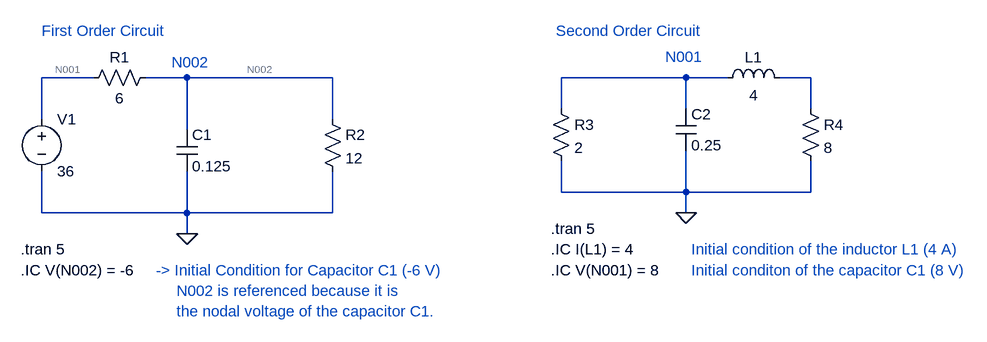
[diagram p0: schematic 03 First and Second Order Circuits.asc]
03 First and Second Order Circuits.asc, the LTspice schematic file:
Version 4
SHEET 1 1616 680
WIRE 224 64 144 64
WIRE 368 64 304 64
WIRE 592 64 368 64
WIRE 1136 64 944 64
WIRE 1200 64 1136 64
WIRE 1328 64 1280 64
WIRE 944 112 944 64
WIRE 1136 112 1136 64
WIRE 1328 112 1328 64
WIRE 144 128 144 64
WIRE 592 128 592 64
WIRE 368 144 368 64
WIRE 944 240 944 192
WIRE 1136 240 1136 176
WIRE 1136 240 944 240
WIRE 1328 240 1328 192
WIRE 1328 240 1136 240
WIRE 144 272 144 208
WIRE 368 272 368 208
WIRE 368 272 144 272
WIRE 592 272 592 208
WIRE 592 272 368 272
WIRE 1136 272 1136 240
WIRE 368 304 368 272
FLAG 368 304 0
FLAG 1136 272 0
SYMBOL voltage 144 112 R0
WINDOW 123 0 0 Left 0
WINDOW 39 0 0 Left 0
SYMATTR InstName V1
SYMATTR Value 36
SYMBOL res 320 48 R90
WINDOW 0 0 56 VBottom 2
WINDOW 3 32 56 VTop 2
SYMATTR InstName R1
SYMATTR Value 6
SYMBOL cap 352 144 R0
SYMATTR InstName C1
SYMATTR Value 0.125
SYMBOL res 576 112 R0
SYMATTR InstName R2
SYMATTR Value 12
SYMBOL res 928 96 R0
SYMATTR InstName R3
SYMATTR Value 2
SYMBOL cap 1120 112 R0
SYMATTR InstName C2
SYMATTR Value 0.25
SYMBOL ind 1184 80 R270
WINDOW 0 32 56 VTop 2
WINDOW 3 5 56 VBottom 2
SYMATTR InstName L1
SYMATTR Value 4
SYMBOL res 1312 96 R0
SYMATTR InstName R4
SYMATTR Value 8
TEXT 112 328 Left 2 !.tran 5
TEXT 112 360 Left 2 !.IC V(N002) = -6
TEXT 144 -8 Left 2 ;First Order Circuit
TEXT 320 360 Left 2 ;-> Initial Condition for Capacitor C1 (-6 V)
TEXT 344 40 Left 2 ;N002
TEXT 352 392 Left 2 ;N002 is referenced because it is \nthe nodal voltage of the capacitor C1.
TEXT 928 296 Left 2 !.tran 5
TEXT 928 328 Left 2 !.IC I(L1) = 4
TEXT 928 360 Left 2 !.IC V(N001) = 8
TEXT 1144 328 Left 2 ;Initial condition of the inductor L1 (4 A)
TEXT 1144 360 Left 2 ;Initial conditon of the capacitor C1 (8 V)
TEXT 1104 32 Left 2 ;N001
TEXT 936 -8 Left 2 ;Second Order Circuit

The netlist it stands for:
* 03 First and Second Order Circuits.asc
V1 N001 0 36
R1 N002 N001 6
C1 N002 0 0.125
R2 N002 0 12
R3 N003 0 2
C2 N003 0 0.25
L1 N003 N004 4
R4 N004 0 8
.tran 5
.IC V(N002) = -6
* First Order Circuit
* -> Initial Condition for Capacitor C1 (-6 V)
* N002
* N002 is referenced because it is
* the nodal voltage of the capacitor C1.
.tran 5
.IC I(L1) = 4
.IC V(N001) = 8
* Initial condition of the inductor L1 (4 A)
* Initial conditon of the capacitor C1 (8 V)
* N001
* Second Order Circuit
.backanno
.end